# Altium schematic sheet output_module.SchDoc
size A4
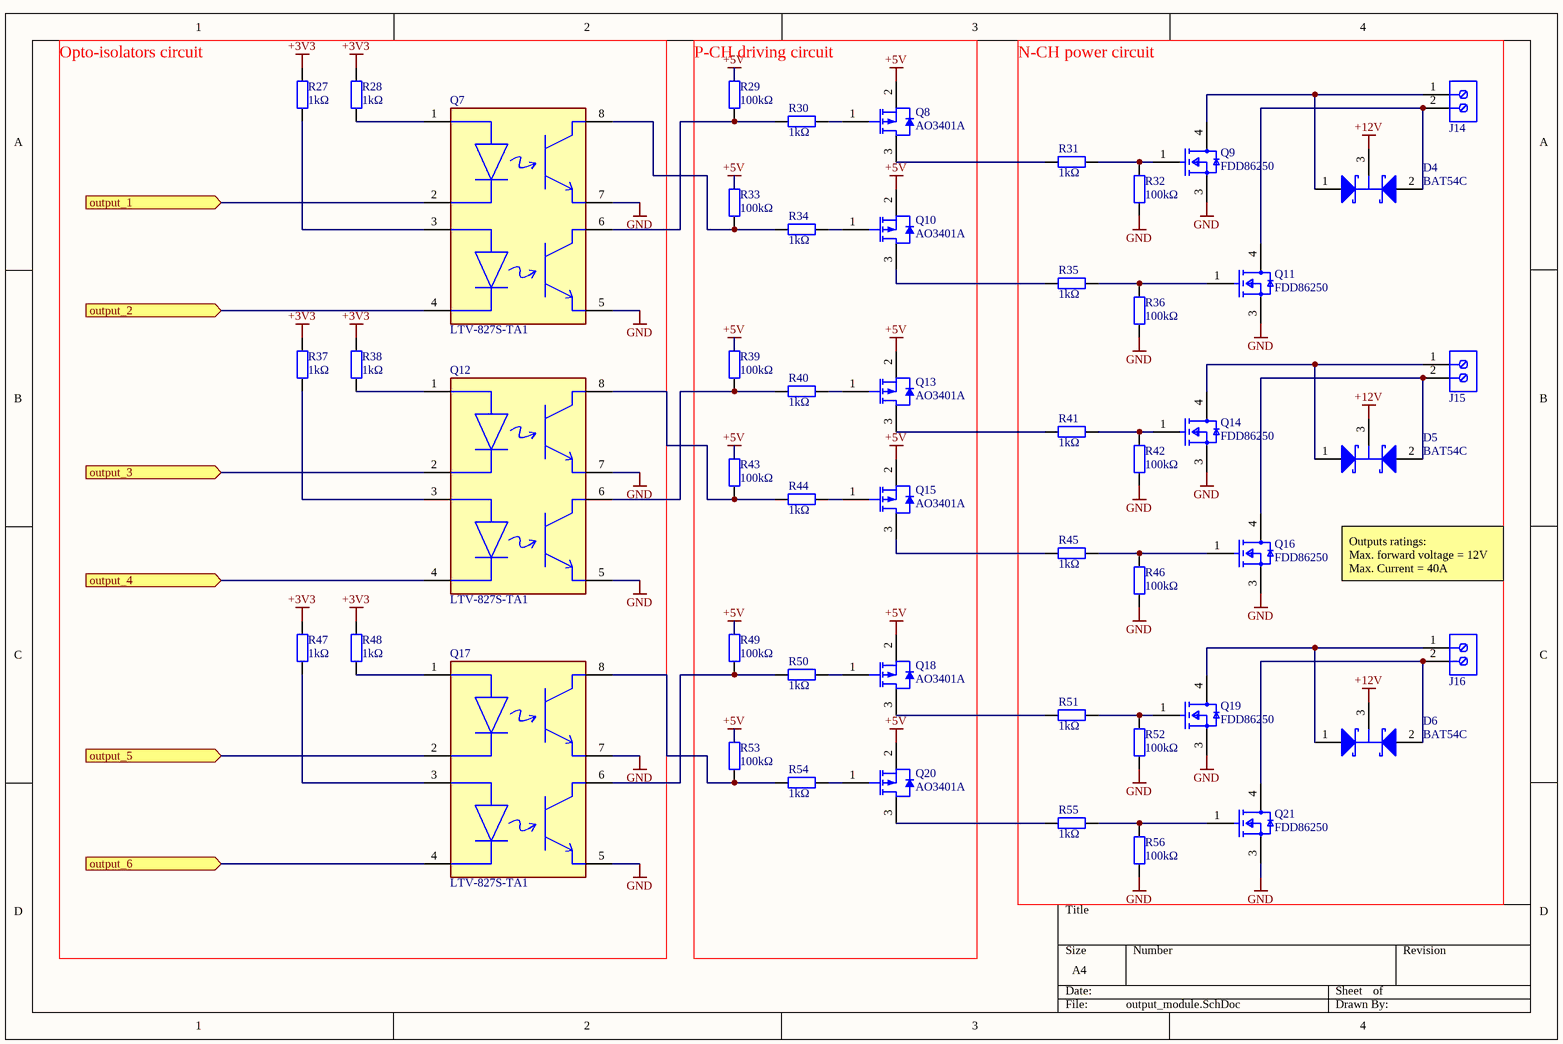
[diagram p0: output_module.SchDoc]

## Parts
D4  BAT54C  [SOT-23]
D5  BAT54C  [SOT-23]
D6  BAT54C  [SOT-23]
J14  282836-2  [TECO-282836-2_V]  (value not drawn)
J15  282836-2  [TECO-282836-2_V]  (value not drawn)
J16  282836-2  [TECO-282836-2_V]  (value not drawn)
Q7  LTV-827S-TA1  [FP-LTV-827S-TA1-MFG]
Q8  AO3401A  [AO-SOT-23-3L_V]
Q9  FDD86250  [FP-369AS-MFG]
Q10  AO3401A  [AO-SOT-23-3L_V]
Q11  FDD86250  [FP-369AS-MFG]
Q12  LTV-827S-TA1  [FP-LTV-827S-TA1-MFG]
Q13  AO3401A  [AO-SOT-23-3L_V]
Q14  FDD86250  [FP-369AS-MFG]
Q15  AO3401A  [AO-SOT-23-3L_V]
Q16  FDD86250  [FP-369AS-MFG]
Q17  LTV-827S-TA1  [FP-LTV-827S-TA1-MFG]
Q18  AO3401A  [AO-SOT-23-3L_V]
Q19  FDD86250  [FP-369AS-MFG]
Q20  AO3401A  [AO-SOT-23-3L_V]
Q21  FDD86250  [FP-369AS-MFG]
R27  1kΩ  [RESC2013X50X30ML20T20]
R28  1kΩ  [RESC2013X50X30ML20T20]
R29  100kΩ  [RESC2013X50X30ML20T20]
R30  1kΩ  [RESC2013X50X30ML20T20]
R31  1kΩ  [RESC2013X50X30ML20T20]
R32  100kΩ  [RESC2013X50X30ML20T20]
R33  100kΩ  [RESC2013X50X30ML20T20]
R34  1kΩ  [RESC2013X50X30ML20T20]
R35  1kΩ  [RESC2013X50X30ML20T20]
R36  100kΩ  [RESC2013X50X30ML20T20]
R37  1kΩ  [RESC2013X50X30ML20T20]
R38  1kΩ  [RESC2013X50X30ML20T20]
R39  100kΩ  [RESC2013X50X30ML20T20]
R40  1kΩ  [RESC2013X50X30ML20T20]
R41  1kΩ  [RESC2013X50X30ML20T20]
R42  100kΩ  [RESC2013X50X30ML20T20]
R43  100kΩ  [RESC2013X50X30ML20T20]
R44  1kΩ  [RESC2013X50X30ML20T20]
R45  1kΩ  [RESC2013X50X30ML20T20]
R46  100kΩ  [RESC2013X50X30ML20T20]
R47  1kΩ  [RESC2013X50X30ML20T20]
R48  1kΩ  [RESC2013X50X30ML20T20]
R49  100kΩ  [RESC2013X50X30ML20T20]
R50  1kΩ  [RESC2013X50X30ML20T20]
R51  1kΩ  [RESC2013X50X30ML20T20]
R52  100kΩ  [RESC2013X50X30ML20T20]
R53  100kΩ  [RESC2013X50X30ML20T20]
R54  1kΩ  [RESC2013X50X30ML20T20]
R55  1kΩ  [RESC2013X50X30ML20T20]
R56  100kΩ  [RESC2013X50X30ML20T20]

## Ports
output_1 (in), output_2 (in), output_3 (in), output_4 (in), output_5 (in), output_6 (in)

## Nets
+3V3: R27.1 R28.1 R37.1 R38.1 R47.1 R48.1
+5V: Q8.2(SOURCE) Q10.2(SOURCE) Q13.2(SOURCE) Q15.2(SOURCE) Q18.2(SOURCE) Q20.2(SOURCE) R29.1 R33.1 R39.1 R43.1 R49.1 R53.1
+12V: D4.3(K) D5.3(K) D6.3(K)
GND: Q7.5(E) Q7.7(E) Q9.3(S) Q11.3(S) Q12.5(E) Q12.7(E) Q14.3(S) Q16.3(S) Q17.5(E) Q17.7(E) Q19.3(S) Q21.3(S) R32.1 R36.1 R42.1 R46.1 R52.1 R56.1
output_1: Q7.2(1_Cathode) ; port output_1
output_2: Q7.4(2_Cathode) ; port output_2
output_3: Q12.2(1_Cathode) ; port output_3
output_4: Q12.4(2_Cathode) ; port output_4
output_5: Q17.2(1_Cathode) ; port output_5
output_6: Q17.4(2_Cathode) ; port output_6
NetD4_1: D4.1(A) J14.1 Q9.4(D)
NetD4_2: D4.2(A) J14.2 Q11.4(D)
NetD5_1: D5.1(A) J15.1 Q14.4(D)
NetD5_2: D5.2(A) J15.2 Q16.4(D)
NetD6_1: D6.1(A) J16.1 Q19.4(D)
NetD6_2: D6.2(A) J16.2 Q21.4(D)
NetQ7_1: Q7.1(1_Anode) R28.2
NetQ7_3: Q7.3(2_Anode) R27.2
NetQ7_6: Q7.6(C) R29.2 R30.1
NetQ7_8: Q7.8(C) R33.2 R34.1
NetQ8_1: Q8.1(GATE) R30.2
NetQ8_3: Q8.3(DRAIN) R31.1
NetQ9_1: Q9.1(G) R31.2 R32.2
NetQ10_1: Q10.1(GATE) R34.2
NetQ10_3: Q10.3(DRAIN) R35.1
NetQ11_1: Q11.1(G) R35.2 R36.2
NetQ12_1: Q12.1(1_Anode) R38.2
NetQ12_3: Q12.3(2_Anode) R37.2
NetQ12_6: Q12.6(C) R39.2 R40.1
NetQ12_8: Q12.8(C) R43.2 R44.1
NetQ13_1: Q13.1(GATE) R40.2
NetQ13_3: Q13.3(DRAIN) R41.1
NetQ14_1: Q14.1(G) R41.2 R42.2
NetQ15_1: Q15.1(GATE) R44.2
NetQ15_3: Q15.3(DRAIN) R45.1
NetQ16_1: Q16.1(G) R45.2 R46.2
NetQ17_1: Q17.1(1_Anode) R48.2
NetQ17_3: Q17.3(2_Anode) R47.2
NetQ17_6: Q17.6(C) R49.2 R50.1
NetQ17_8: Q17.8(C) R53.2 R54.1
NetQ18_1: Q18.1(GATE) R50.2
NetQ18_3: Q18.3(DRAIN) R51.1
NetQ19_1: Q19.1(G) R51.2 R52.2
NetQ20_1: Q20.1(GATE) R54.2
NetQ20_3: Q20.3(DRAIN) R55.1
NetQ21_1: Q21.1(G) R55.2 R56.2

## Notes on the sheet
- Outputs ratings:
  Max. forward voltage = 12V
  Max. Current = 40A
- N-CH power circuit
- Opto-isolators circuit
- P-CH driving circuit

## Library data of the parts
D4-D6 = DIODE_BAT54C: Schottky Barrier Diode, 30 V, 3-Pin SOT23, RoHS, Tape and Reel; Manufacturer: NXP Semiconductors; Forward Surge Current Ifsm Max: 600mA; Pin Configuration: 1A1,2A2,3comK; Package Version: Feb-16; Forward Voltage VF Max: 800mV; SMD Marking: L43/*W1; Reverse Recovery Time trr Typ: 5ns; Forward Current If(AV): 200mA; Reel Quantity: 3000; SVHC: NoSVHC(19-Dec-2012); No. of Pins: 3; Junction Temperature Tj Max: 125degC; Common Connection: Cathode; Repetitive Reverse Voltage Vrrm Max: 30V; Operating Temperature Max: 150degC; Operating Temperature Range: -65degCto+150degC; Diode Case Style: SOT-23; Termination Type: SMD; Package Description: 3-Pin Small Outline Transistor, Body 1.3 x 2.9 mm, Pitch 0.95 mm; Package / Case: SOT-23; Diode Type: Schottky; Manufacturer URL: http://www.nxp.com/; Tape Width: 8mm; Package Reference: SOT23-3; Datasheet URL: https://datasheet.ciiva.com/33723/1668625-33723936.pdf; Datasheet Version: Rev. 5 , 10/2012; Operating Temperature Min: -65degC; Current Ifsm: 600mA; Reverse Recovery Time trr Max: 5ns; Package URL: http://www.nxp.com/documents/outline_drawing/SOT23.pdf; Forward Voltage: 800mV
J14-J16 = CMP-1684-00017-1: Female Header, Pitch 5 mm, 1 x 2 Position, Height 10 mm, Tail Length 3.5 mm, Rohs, Bulk; Manufacturer: TE Connectivity; Wire Gauge: 16-30AWG; Product Training Modules: Wire-to-BoardEurostyleTerminalBlocks; Clamp Material - Plating: Brass-NickelPlated; Voltage: 300V; Mating Orientation: HorizontalwithBoard; Current: 13.5A; Pitch: 0.197"(5.00mm); Screw Thread: M3; 3D Model: 282836-2.pdf; Other Names: 5ULV-02B / A98076; Dynamic Catalog: BuchananSeries; Number of Levels: 1; Torque - Screw: 0.68Nm(6Lb-In); Featured Product: EurostyleTerminalBlockConnectors; Positions Per Level: 2; Wire Termination: Screw-RisingCageClamp; Datasheet URL: http://www.te.com.cn/commerce/DocumentDelivery/DDEController?Action=showdoc&DocId=Catalog+Section%7F1308389_EUROSTYLE_TERMINAL_BLOCKS%7F0607%7Fpdf%7FEnglish%7FENG_CS_1308389_EUROSTYLE_TERMINAL_BLOCKS_0607.pdf%7F282836-2; Color: Green; Family: TerminalBlocks-WiretoBoard; RoHS Information: 282836-2StatementofCompliance; Standard Package: 300; Contact Material - Plating: Brass-TinPlated; Manufacturer URL: http://www.te.com; Housing Material: Polyamide(PA66),Nylon6/6; Features: Interlocking(Side); Package Description: Female Header, Pitch 5 mm, 1 x 2 Position, Height 10 mm, Tail Length 3.5 mm; Mounting Type: ThroughHole; Package Reference: THD; Packaging: Bulk; Series: Buchanan; Category: Connectors,Interconnects; Screw Material - Plating: Brass-NickelPlated
Q7 Q12 Q17 = CMP-22018-000005-1: OPTOISOLATOR 5KV 2CH TRANS 8-SMD; Number of Channels: 2; Forward Current: 50mA; Reverse Breakdown Voltage: 6V; Current Transfer Ratio: 600%; Collector Emitter Saturation Voltage: 200mV; Collector Emitter Voltage (VCEO): 35V; Max Power Dissipation: 200mW; Rise Time: 18000ns; Forward Voltage: 1.4V; Number of Elements: 2; Min Operating Temperature: -30°C; Number of Circuits: 2; Max Collector Current: 50mA; Packaging: Tape and Reel; Max Input Current: 50mA; Case/Package: SMD/SMT; Radiation Hardening: No; Package Quantity: 1000; Max Output Voltage: 35V; Output Current per Channel: 50mA; Fall Time: 18000ns; Mount: Surface Mount; Isolation Voltage: 5kV; Power Dissipation: 200mW; Lead Free: Lead Free; Max Operating Temperature: 110°C; Output Voltage: 35V; Number of Pins: 8
Q8 Q10 Q13 Q15 Q18 Q20 = CMP-2000-05778-1: P-Channel MOSFET, 30 V, 4 A, -55 to 150 degC, 3-Pin SOT-23-3L, RoHS, Tape and Reel; Manufacturer: Alpha and Omega; Output Power (Max): NotRequiredW; Power Dissipation: 1.4W; Rad Hardened: No; Drain Efficiency: NotRequired%; Drain-Source On-Volt: 30V; Noise Figure: NotRequireddB; Frequency (Max): NotRequiredMHz; Number of  Elements: 1; Gate-Source Voltage (Max): ?12V; Drain Current (Max): 4A; Channel Mode: Enhancement; Drain-Source On-Res: 0.044ohm; Type: PowerMOSFET; Polarity: P; Package URL: http://www.aosmd.com/res/packaging_information/SOT-23-3L.pdf; Datasheet URL: http://www.aosmd.com/res/data_sheets/AO3401A.pdf; Package Type: SOT-23; Package Description: 3-Pin Small Outline Transistor, Body 2.95 x 1.6 mm, Pitch 0.95 mm; Mounting: SurfaceMount; Manufacturer URL: http://www.aosmd.com/; Continuous Drain Current: 4A; Package Reference: SOT-23-3L; Mounting Technology: SurfaceMount; Operating Temperature Classification: Military; Power Gain: NotRequireddB; Datasheet Version: Rev. 3, 03/2011; Operating Temp Range: -55Cto150C; Pin Count: 3
Q9 Q11 Q14 Q16 Q19 Q21 = CMP-07173-000037-1: MOSFET N-CH 150V 8A DPAK; Manufacturer: ON Semiconductor; Threshold Vgs Max: 4V; Power Dissipation: 3.1W; Gate Charge At Vgs: 23nC @ 10V; Turn On Delay Time: 11.2ns; Reverse Recovery Charge: 104nC; Max Forward Diode Voltage: 1.3V; Pulse Drain Current: 164A; Max Junction Temp: +150°C; Depletion Mode: False; Rthja Max: 40°C/W; Input Capacitace At Vds: 1585pF @ 75V; Number Of N Channels: 1; Gate To Source Voltage: 20V; Reverse Recovery Time: 71ns; Threshold Vgs Min: 2V; Typ Forward Diode Voltage: 0.78V; Transconductance: 28S; Drain To Source Resistance: 18.4mΩ; Turn Off Delay Time: 20ns; Footprint Url: https://www.onsemi.com/pub/Collateral/369AS.PDF; Automotive: No; Continuous Drain Current: 8A; Digikey Description: MOSFET N-CH 150V 8A DPAK; RoHS: TRUE; Device Class L1: Discrete Semiconductors; ComponentLink2URL: https://www.onsemi.com/pub/Collateral/FDD86250-D.pdf; Lead Free: Yes; Drain To Source Breakdown Voltage: 150V; Octopart: https://octopart.com/fdd86250-on+semiconductor-84325855; Temperature Range Low: -55°C; Device Class L3: MOSFETs; Manufacturer Part Number: FDD86250; Package: 369AS; Temperature Range High: +150°C; Category: Trans; Mouser Description: Shielded Gate PowerTrench® MOSFET, N-Channel, 150 V, 51 A, 22 mO; ComponentLink2Description: Datasheet; Temperature: -55°C to +150°C; Drain To Source Voltage: 150V; Number Of Channels: 1; Height: 2.517mm; Device Class L2: Transistors
R27-R56 = Res_0805: Resistor